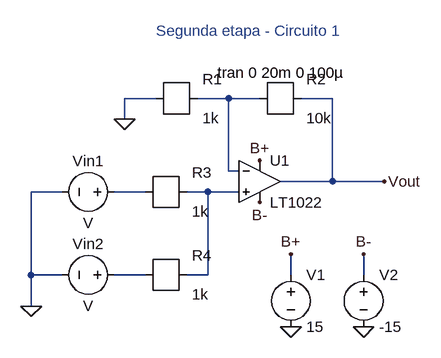
[diagram p0: schematic Lab3_2_1.asc]
Lab3_2_1.asc, the LTspice schematic file:
Version 4
SHEET 1 880 680
WIRE 272 224 224 224
WIRE 384 224 336 224
WIRE 432 224 384 224
WIRE 544 224 496 224
WIRE 224 256 224 224
WIRE 384 336 384 224
WIRE 400 336 384 336
WIRE 544 352 544 224
WIRE 544 352 464 352
WIRE 624 352 544 352
WIRE 128 368 80 368
WIRE 256 368 208 368
WIRE 352 368 320 368
WIRE 400 368 352 368
WIRE 80 496 80 368
WIRE 128 496 80 496
WIRE 256 496 208 496
WIRE 352 496 352 368
WIRE 352 496 320 496
WIRE 480 496 480 464
WIRE 592 496 592 464
WIRE 80 544 80 496
FLAG 592 576 0
FLAG 480 576 0
FLAG 592 464 B-
FLAG 480 464 B+
FLAG 432 384 B-
FLAG 432 320 B+
FLAG 624 352 Vout
FLAG 224 256 0
FLAG 80 544 0
SYMBOL opamps/LT1022 432 288 R0
SYMATTR InstName U1
SYMBOL voltage 480 480 R0
SYMATTR InstName V1
SYMATTR Value 15
SYMBOL voltage 592 480 R0
SYMATTR InstName V2
SYMATTR Value -15
SYMBOL r 272 224 R0
SYMATTR InstName R1
SYMATTR Value 1k
SYMBOL r 432 224 R0
SYMATTR InstName R2
SYMATTR Value 10k
SYMBOL voltage 224 368 R90
WINDOW 0 -32 56 VBottom 2
WINDOW 3 32 56 VTop 2
SYMATTR InstName Vin1
SYMBOL voltage 224 496 R90
WINDOW 0 -32 56 VBottom 2
WINDOW 3 32 56 VTop 2
SYMATTR InstName Vin2
SYMBOL r 256 368 R0
SYMATTR InstName R3
SYMATTR Value 1k
SYMBOL r 256 496 R0
SYMATTR InstName R4
SYMATTR Value 1k
TEXT 360 184 Left 2 !.tran 0 20m 0 100µ
TEXT 272 120 Left 2 ;Segunda etapa - Circuito 1

The netlist it stands for:
* Lab3_2_1.asc
XU1 N003 N001 B+ B- Vout LT1022  ; pins In+ In- V+ V- OUT
V1 B+ 0 15
V2 B- 0 -15
R1 N001 0 1k
R2 Vout N001 10k
Vin1 N002 0 V
Vin2 N004 0 V
R3 N003 N002 1k
R4 N003 N004 1k
.tran 0 20m 0 100µ
* Segunda etapa - Circuito 1
.backanno
.end